# EAGLE design ppt_full_charger_f1 (EAGLE 8.7.1)

## Sheet 1 of 3
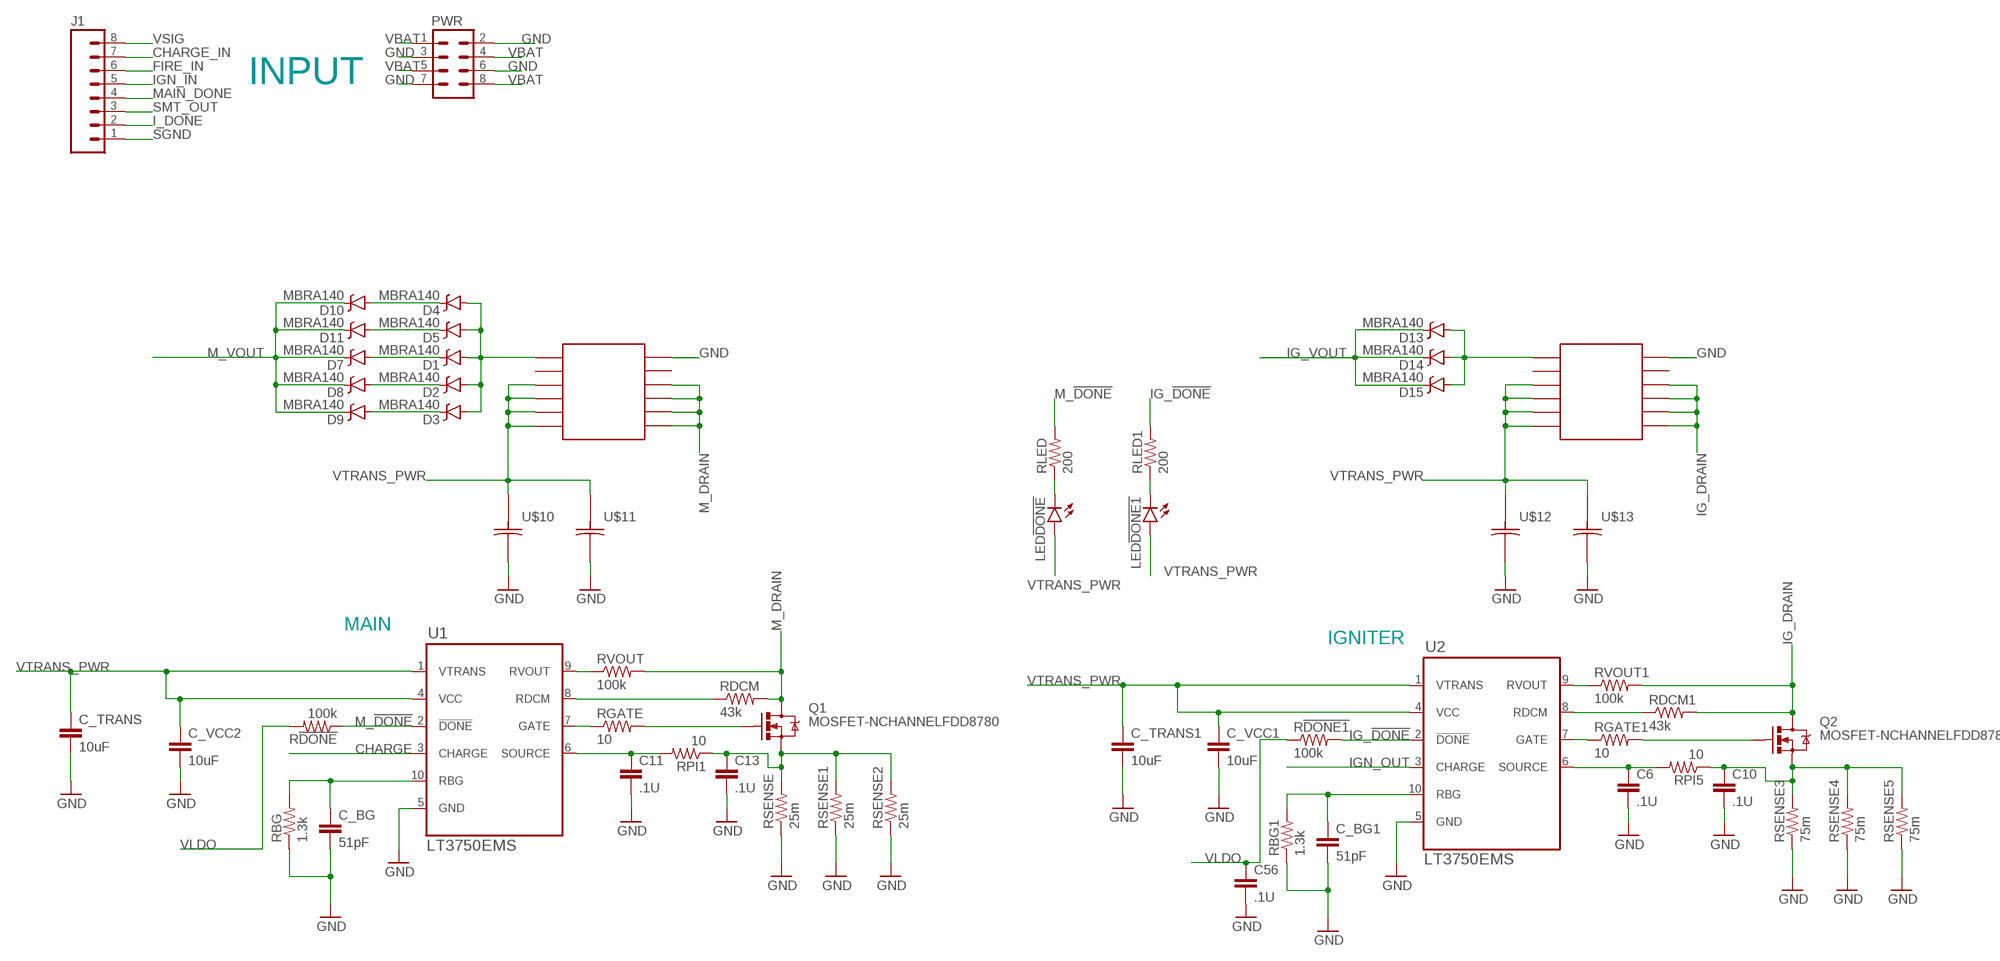
[diagram p0: schematic, sheet 1]

### Parts
C6  .1U  CAP0805  [0805]
C10  .1U  CAP0805  [0805]
C11  .1U  CAP0805  [0805]
C13  .1U  CAP0805  [0805]
C56  .1U  CAP0805  [0805]
C_BG  51pF  CAP0805  [0805]
C_BG1  51pF  CAP0805  [0805]
C_TRANS  10uF  CAP0805  [0805]
C_TRANS1  10uF  CAP0805  [0805]
C_VCC1  10uF  CAP0805  [0805]
C_VCC2  10uF  CAP0805  [0805]
D1  MBRA140  [SMA-DIODE]
D2  MBRA140  [SMA-DIODE]
D3  MBRA140  [SMA-DIODE]
D4  MBRA140  [SMA-DIODE]
D5  MBRA140  [SMA-DIODE]
D7  MBRA140  [SMA-DIODE]
D8  MBRA140  [SMA-DIODE]
D9  MBRA140  [SMA-DIODE]
D10  MBRA140  [SMA-DIODE]
D11  MBRA140  [SMA-DIODE]
D13  MBRA140  [SMA-DIODE]
D14  MBRA140  [SMA-DIODE]
D15  MBRA140  [SMA-DIODE]
J1  M08  [1X08_ROUND]
LED!DONE  LED1206  [LED-1206]
LED!DONE1  LED1206  [LED-1206]
PWR  M04X2  [2X4]
Q1  MOSFET-NCHANNELFDD8780  [DPAK]
Q2  MOSFET-NCHANNELFDD8780  [DPAK]
R!DONE  100k  RESISTOR0805-RES  [0805]
R!DONE1  100k  RESISTOR0805-RES  [0805]
RBG  1.3k  RESISTOR0805-RES  [0805]
RBG1  1.3k  RESISTOR0805-RES  [0805]
RDCM  43k  RESISTOR0805-RES  [0805]
RDCM1  43k  RESISTOR0805-RES  [0805]
RGATE  10  RESISTOR0805-RES  [0805]
RGATE1  10  RESISTOR0805-RES  [0805]
RLED  200  RESISTOR0805-RES  [0805]
RLED1  200  RESISTOR0805-RES  [0805]
RPI1  10  RESISTOR0805-RES  [0805]
RPI5  10  RESISTOR0805-RES  [0805]
RSENSE  25m  RESISTOR1206  [1206]
RSENSE1  25m  RESISTOR1206  [1206]
RSENSE2  25m  RESISTOR1206  [1206]
RSENSE3  75m  RESISTOR1206  [1206]
RSENSE4  75m  RESISTOR1206  [1206]
RSENSE5  75m  RESISTOR1206  [1206]
RVOUT  100k  RESISTOR0805-RES  [0805]
RVOUT1  100k  RESISTOR0805-RES  [0805]
U1  LT3750EMS  [MSOP10]
U2  LT3750EMS  [MSOP10]
U$1  COILCRAFT_DA2034  [DA2034]
U$2  COILCRAFT_DA2033  [DA2033]
U$10  PANASONIC_16SVPG270M  [PANASONIC_SVPG]
U$11  PANASONIC_16SVPG270M  [PANASONIC_SVPG]
U$12  PANASONIC_16SVPG270M  [PANASONIC_SVPG]
U$13  PANASONIC_16SVPG270M  [PANASONIC_SVPG]

### Nets
7: RGATE1.1 U2.7(GATE)
8: RDCM1.1 U2.8(RDCM)
9: RVOUT1.1 U2.9(RVOUT)
CHARGE: U1.3(CHARGE) ; also sheet 3
CHARGE_IN: J1.7 ; also sheet 3
FIRE_IN: J1.6 ; also sheet 3
GND: C6.2 C10.2 C11.2 C13.2 C56.2 C_BG1.2 C_BG.2 C_TRANS1.2 C_TRANS.2 C_VCC1.2 C_VCC2.2 PWR.2 PWR.3 PWR.6 PWR.7 RBG1.1 RBG.1 RSENSE1.1 RSENSE2.1 RSENSE3.1 RSENSE4.1 RSENSE5.1 RSENSE.1 U1.5(GND) U2.5(GND) U$1.P$12 U$2.P$12 U$10.NEG U$11.NEG U$12.NEG U$13.NEG ; also sheet 2,3
I_DONE: J1.2 ; also sheet 3
IG_!DONE: R!DONE1.2 RLED1.2 U2.2(!DONE) ; also sheet 3
IG_BG: C_BG1.1 RBG1.2 U2.10(RBG)
IG_DRAIN: Q2.4(D) RDCM1.2 RVOUT1.2 U$2.P$7 U$2.P$8 U$2.P$9 U$2.P$10
IG_GATE: Q2.1(G) RGATE1.2
IG_SENSE: C10.1 Q2.3(S) RPI5.1 RSENSE3.2 RSENSE4.2 RSENSE5.2
IG_VOUT: D13.C D14.C D15.C ; also sheet 2
IGN_IN: J1.5 ; also sheet 3
IGN_OUT: U2.3(CHARGE) ; also sheet 3
M_!DONE: R!DONE.1 RLED.2 U1.2(!DONE) ; also sheet 3
M_BG: C_BG.1 RBG.2 U1.10(RBG)
M_DRAIN: Q1.4(D) RDCM.2 RVOUT.2 U$1.P$7 U$1.P$8 U$1.P$9 U$1.P$10
M_GATE: Q1.1(G) RGATE.2
M_SENSE: C13.1 Q1.3(S) RPI1.1 RSENSE1.2 RSENSE2.2 RSENSE.2
M_VOUT: D7.C D8.C D9.C D10.C D11.C ; also sheet 2
MAIN_DONE: J1.4 ; also sheet 3
N$1: C6.1 RPI5.2 U2.6(SOURCE)
N$3: RVOUT.1 U1.9(RVOUT)
N$4: D4.C D10.A
N$5: RDCM.1 U1.8(RDCM)
N$6: RGATE.1 U1.7(GATE)
N$7: D5.C D11.A
N$10: D1.C D7.A
N$11: D2.C D8.A
N$12: D3.C D9.A
N$15: LED!DONE.C RLED.1
N$17: LED!DONE1.C RLED1.1
N$18: D1.A D2.A D3.A D4.A D5.A U$1.P$1
N$20: C11.1 RPI1.2 U1.6(SOURCE)
N$24: D13.A D14.A D15.A U$2.P$1
SGND: J1.1 ; also sheet 3
SMT_OUT: J1.3 ; also sheet 3
VBAT: PWR.1 PWR.4 PWR.5 PWR.8 ; also sheet 3
VLDO: C56.1 R!DONE1.1 R!DONE.2 ; also sheet 2,3
VSIG: J1.8 ; also sheet 3
VTRANS_PWR: C_TRANS1.1 C_TRANS.1 C_VCC1.1 C_VCC2.1 LED!DONE1.A LED!DONE.A U1.1(VTRANS) U1.4(VCC) U2.1(VTRANS) U2.4(VCC) U$1.P$3 U$1.P$4 U$1.P$5 U$1.P$6 U$2.P$3 U$2.P$4 U$2.P$5 U$2.P$6 U$10.POS U$11.POS U$12.POS U$13.POS ; also sheet 2,3
Unconnected: U$1.P$2 U$1.P$11 U$2.P$2 U$2.P$11

### Notes on the sheet
- INPUT
- MAIN
- IGNITER

## Sheet 2 of 3
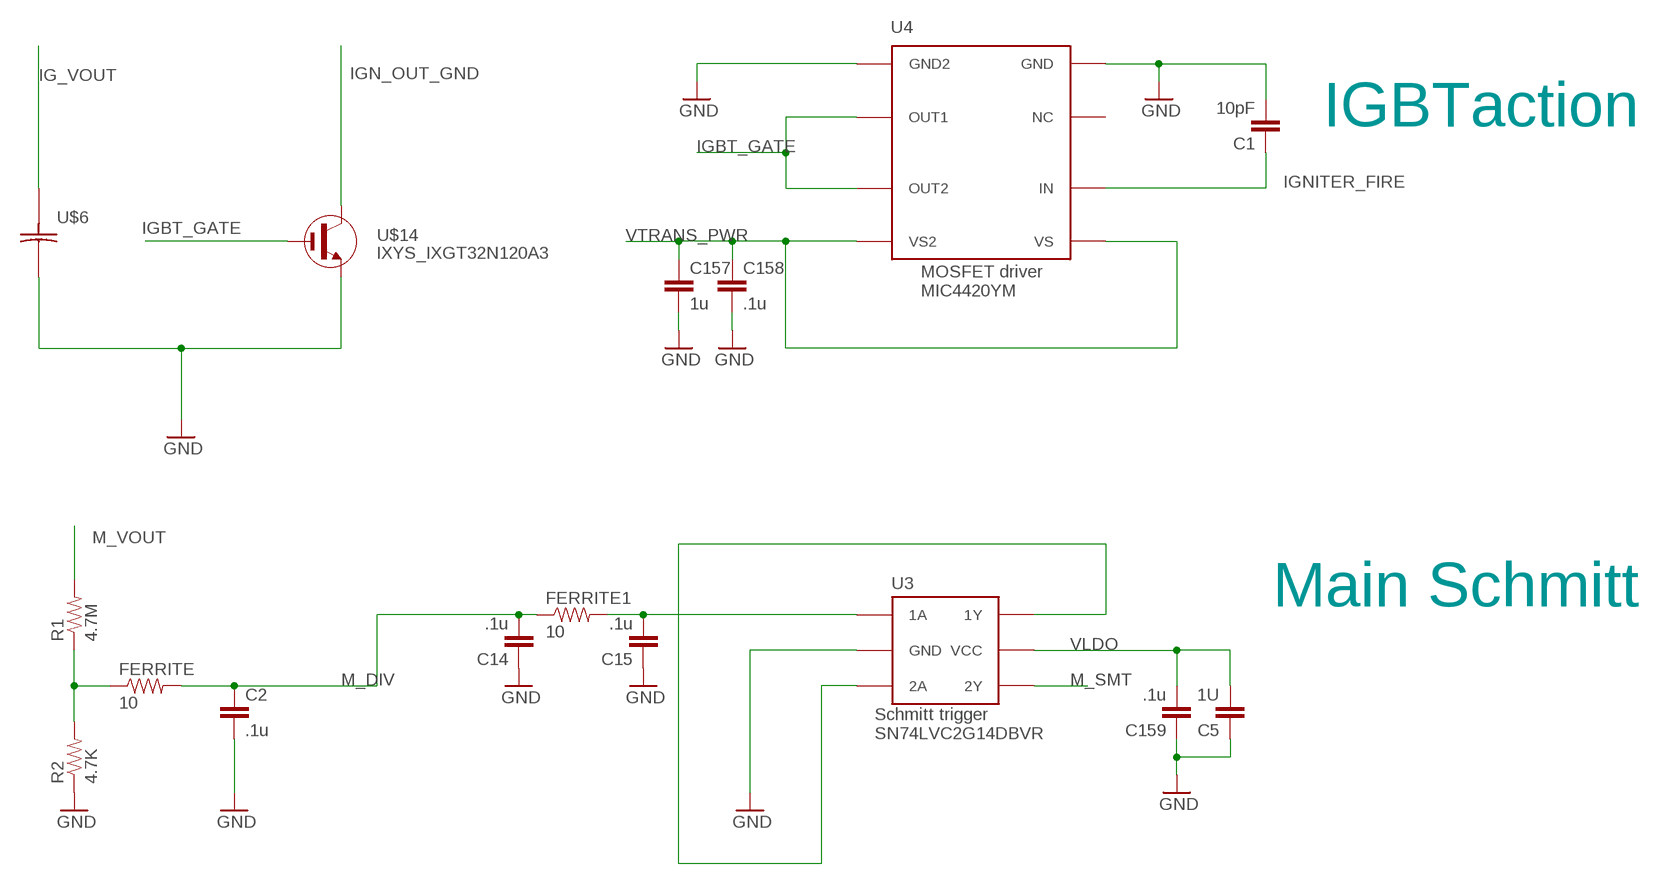
[diagram p1: schematic, sheet 2]

### Parts
C1  10pF  CAP0805  [0805]
C2  .1u  CAP0805  [0805]
C5  1U  CAP0805  [0805]
C14  .1u  CAP0805  [0805]
C15  .1u  CAP0805  [0805]
C157  1u  CAP0805  [0805]
C158  .1u  CAP0805  [0805]
C159  .1u  CAP0805  [0805]
FERRITE  10  RESISTOR0805-RES  [0805]
FERRITE1  10  RESISTOR0805-RES  [0805]
R1  4.7M  RESISTOR2010  [R2010]
R2  4.7K  RESISTOR2010  [R2010]
U3  TI_SCHMITTRIGGER_SN74  [SOT-23-6]
U4  MICREL_MOSFETDRIVER_MIC4420  [8-SOIC]
U$6  KEMET_LDEQH3100KA5N00  [KEMET_F3078]
U$14  IXYS_IXGT32N120A3  [TO-268]

### Nets
GND: C1.2 C2.2 C5.1 C14.1 C15.1 C157.2 C158.2 C159.1 R2.1 U3.P$2(GND) U4.P$4(GND) U4.P$5(GND2) U$6.NEG U$14.3(E) ; also sheet 1,3
IG_VOUT: U$6.POS ; also sheet 1
IGBT_GATE: U4.P$6(OUT1) U4.P$7(OUT2) U$14.1(G)
IGN_OUT_GND: U$14.2(C)
IGNITER_FIRE: C1.1 U4.P$2(IN) ; also sheet 3
M_DIV: C2.1 C14.2 FERRITE1.1 FERRITE.2
M_SMT: U3.P$4(2Y) ; also sheet 3
M_VOUT: R1.2 ; also sheet 1
N$2: U3.P$3(2A) U3.P$6(1Y)
N$8: C15.2 FERRITE1.2 U3.P$1(1A)
N$14: FERRITE.1 R1.1 R2.2
VLDO: C5.2 C159.2 U3.P$5(VCC) ; also sheet 1,3
VTRANS_PWR: C157.1 C158.1 U4.P$1(VS) U4.P$8(VS2) ; also sheet 1,3
Unconnected: U4.P$3(NC)

### Notes on the sheet
- IGBTaction
- Main Schmitt

## Sheet 3 of 3
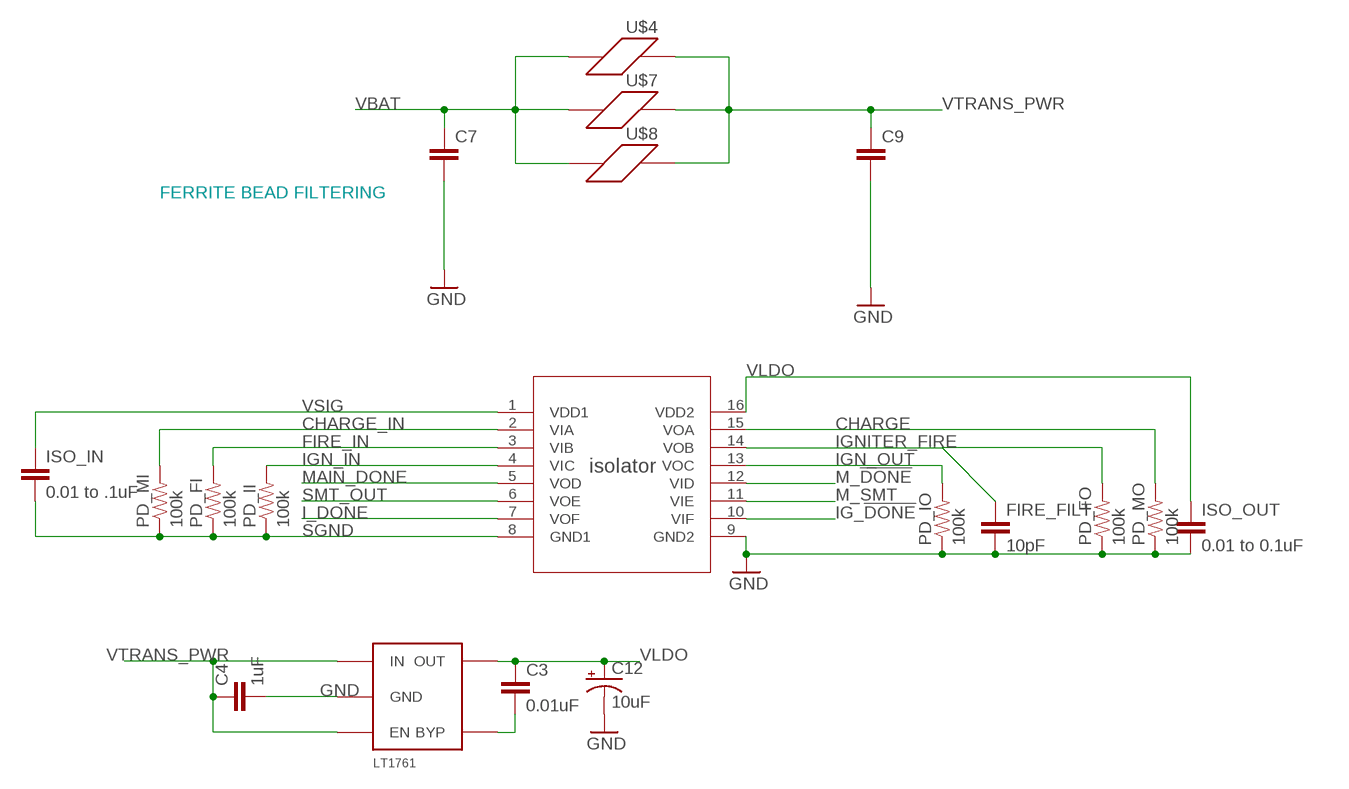
[diagram p2: schematic, sheet 3]

### Parts
ADUM163N  ADUM163N1BRZ  [R_16]
C3  0.01uF  CAP0805  [0805]
C4  1uF  CAP0805  [0805]
C7  CAP0805  [0805]
C9  CAP0805  [0805]
C12  10uF  10UF-TANT  [EIA3216]
FIRE_FILT  10pF  CAP0805  [0805]
ISO_IN  0.01 to .1uF  CAP0805  [0805]
ISO_OUT  0.01 to 0.1uF  CAP0805  [0805]
LDO  LINEAR_LDO_LT1761-X  [SOT-23-5]
PD_FI  100k  RESISTOR0805-RES  [0805]
PD_FO  100k  RESISTOR0805-RES  [0805]
PD_II  100k  RESISTOR0805-RES  [0805]
PD_IO  100k  RESISTOR0805-RES  [0805]
PD_MI  100k  RESISTOR0805-RES  [0805]
PD_MO  100k  RESISTOR0805-RES  [0805]
U$4  B.L1_FBMJ2125HS420-T  [0805]
U$7  B.L2_FBMH1608HL121-T  [0603]
U$8  I.L1_587-3855-1-ND  [1206]

### Nets
CHARGE: ADUM163N.15(VOA) PD_MO.2 ; also sheet 1
CHARGE_IN: ADUM163N.2(VIA) PD_MI.2 ; also sheet 1
FIRE_IN: ADUM163N.3(VIB) PD_FI.2 ; also sheet 1
GND: ADUM163N.9(GND2) C4.2 C7.2 C9.2 C12.C(-) FIRE_FILT.2 ISO_OUT.2 LDO.P$2(GND) PD_FO.1 PD_IO.1 PD_MO.1 ; also sheet 1,2
I_DONE: ADUM163N.7(VOF) ; also sheet 1
IG_!DONE: ADUM163N.10(VIF) ; also sheet 1
IGN_IN: ADUM163N.4(VIC) PD_II.2 ; also sheet 1
IGN_OUT: ADUM163N.13(VOC) PD_IO.2 ; also sheet 1
IGNITER_FIRE: ADUM163N.14(VOB) FIRE_FILT.1 PD_FO.2 ; also sheet 2
M_!DONE: ADUM163N.12(VID) ; also sheet 1
M_SMT: ADUM163N.11(VIE) ; also sheet 2
MAIN_DONE: ADUM163N.5(VOD) ; also sheet 1
N$25: C3.2 LDO.P$4(BYP)
SGND: ADUM163N.8(GND1) ISO_IN.2 PD_FI.1 PD_II.1 PD_MI.1 ; also sheet 1
SMT_OUT: ADUM163N.6(VOE) ; also sheet 1
VBAT: C7.1 U$4.1 U$7.1 U$8.1 ; also sheet 1
VLDO: ADUM163N.16(VDD2) C3.1 C12.A(+) ISO_OUT.1 LDO.P$5(OUT) ; also sheet 1,2
VSIG: ADUM163N.1(VDD1) ISO_IN.1 ; also sheet 1
VTRANS_PWR: C4.1 C9.1 LDO.P$1(IN) LDO.P$3(EN) U$4.2 U$7.2 U$8.2 ; also sheet 1,2

### Notes on the sheet
- FERRITE BEAD FILTERING

## Library data of the parts
ADUM163N = paige1:ADUM163N1BRZ
C1 C2 C5-C7 C9-C11 C13-C15 C56 C157-C159 C_BG C_BG1 C_TRANS C_TRANS1 C_VCC1 C_VCC2 = SparkFun-Capacitors:CAP: Capacitor Standard 0603 ceramic capacitor, and 0.1" leaded capacitor.
C3 C4 FIRE_FILT ISO_IN ISO_OUT = SparkFun-Passives:CAP: Capacitor Standard 0603 ceramic capacitor, and 0.1" leaded capacitor.
C12 = SparkFun-Retired:10UF-TANT: 10uF Tantalum SMT CAP-00811- 16V 10% (EIA-3216); PROD_ID: CAP-00811
D1-D5 D7-D11 D13-D15 = SparkFun-DiscreteSemi:MBRA140: 40V, 1A Schottky rectifier SMA/DO-214AC package DIO-08053; PROD_ID: DIO-08053
FERRITE FERRITE1 PD_FI PD_FO PD_II PD_IO PD_MI PD_MO R1 R2 RLED RLED1 = SparkFun-Passives:RESISTOR: Resistor Basic schematic elements and footprints for 0603, 1206, and PTH resistors.
J1 = SparkFun-Connectors:M08: Header 8 Standard 8-pin 0.1" header. Use with straight break away headers (SKU : PRT-00116), right angle break away headers (PRT-00553), swiss pins (PRT-00743), machine pins (PRT-00117), and female headers (PRT-00115).; PROD_ID: CONN-08437
LDO = DubSat1 Components:LINEAR_LDO_LT1761-X
LED!DONE LED!DONE1 = SparkFun-LED:LED: LEDs Standard schematic elements and footprints for 5mm, 3mm, 1206, and 0603 sized LEDs. 5mm - Spark Fun Electronics SKU : COM-00529 (and others)
PWR = SparkFun-Connectors:M04X2: .1" header, two rows of four.
Q1 Q2 = SparkFun-DiscreteSemi:MOSFET-NCHANNEL: Common NMOSFET Parts MFG P/N Store ID Prod ID FDD8780 TRANS-09984 SI7820DN TRANS-11055 FDS6630A IC-08089 2N7002PW TRANS-11151 FQP30N06L COM-10213 TRANS-10060 BSS123LT1G TRANS-08345 BSS138 TRANS-00830 BS170 2N7000; PROD_ID: TRANS-09984
R!DONE R!DONE1 RBG RBG1 RDCM RDCM1 RGATE RGATE1 RPI1 RPI5 RVOUT RVOUT1 = SparkFun-Resistors:RESISTOR: Resistor Basic schematic elements and footprints for 0603, 1206, and PTH resistors.
RSENSE RSENSE1-RSENSE5 = DubSat1 Components:RESISTOR: Resistor Basic schematic elements and footprints for 0603, 1206, and PTH resistors.
U1 U2 = linear-technology:LT3750EMS: Description: The LT®3750 is a flyback converter designed to rapidly charge large capacitors to a user-adjustable target voltage. See more information in the datasheet at: http://cds.linear.com/docs/en/datasheet/3750fa.pdf
U3 = ICs:TI_SCHMITTRIGGER_SN74
U4 = ICs:MICREL_MOSFETDRIVER_MIC4420
U$1 = Transformers:COILCRAFT_DA2034
U$2 = Transformers:COILCRAFT_DA2033
U$4 = Ferrite:B.L1_FBMJ2125HS420-T: Taiyo Yuden 0805 package ferrite bead high frequency filter. Download the datasheet here <http://ds.yuden.co.jp/TYCOMPAS/ut/detail.do?productNo=FBMJ2125HS420-T&fileName=FBMJ2125HS420-T_SS&mode=specSheetDownload>.
U$6 = Capacitors:KEMET_LDEQH3100KA5N00
U$7 = Ferrite:B.L2_FBMH1608HL121-T: Taiyo Yuden 0603 package ferrite bead high frequency filter. Download the datasheet here <http://ds.yuden.co.jp/TYCOMPAS/ut/detail.do?productNo=FBMJ2125HS420-T&fileName=FBMJ2125HS420-T_SS&mode=specSheetDownload>.
U$8 = Ferrite:I.L1_587-3855-1-ND: Taiyo Yuden 1206 package ferrite bead high frequency filter. Download the datasheet here <http://ds.yuden.co.jp/TYCOMPAS/ut/detail.do?productNo=FBMJ3216HS480NTV&fileName=FBMJ3216HS480NTV_SS&mode=specSheetDownload>.
U$10-U$13 = Capacitors:PANASONIC_16SVPG270M
U$14 = Semiconductors:IXYS_IXGT32N120A3

## Board
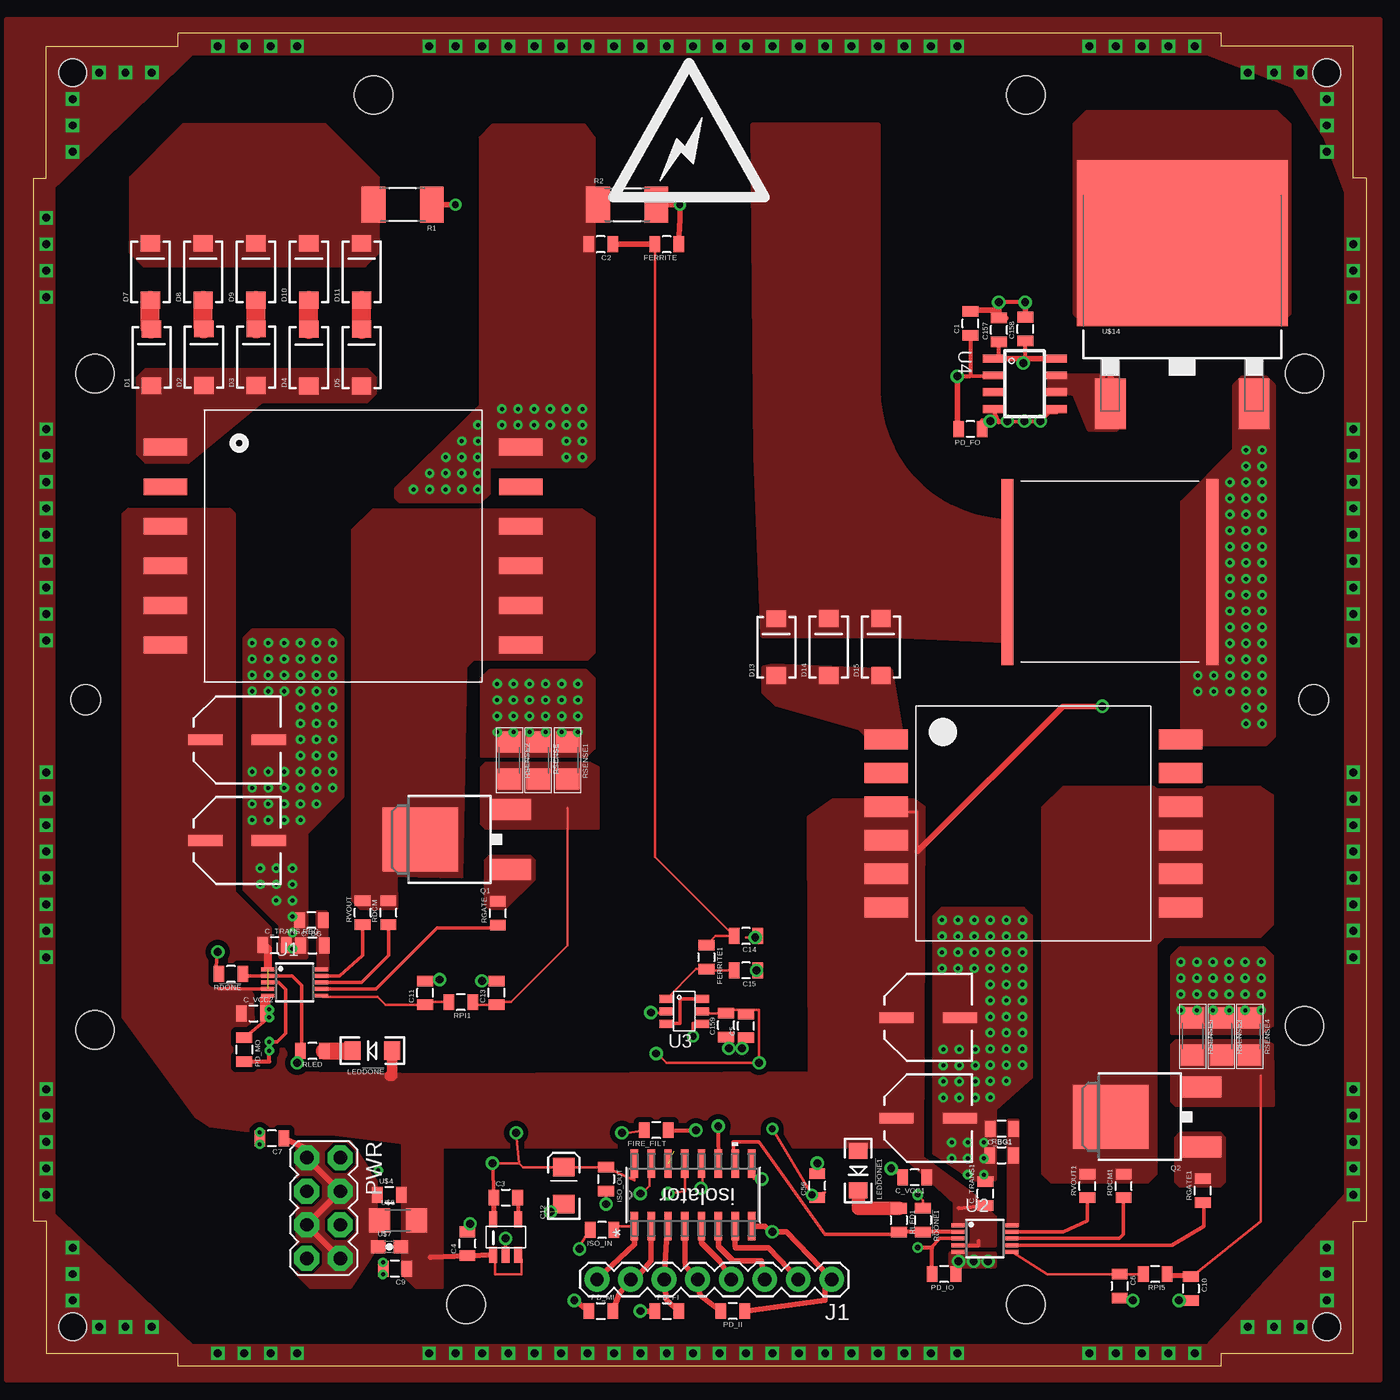
[diagram p3: board, top side]
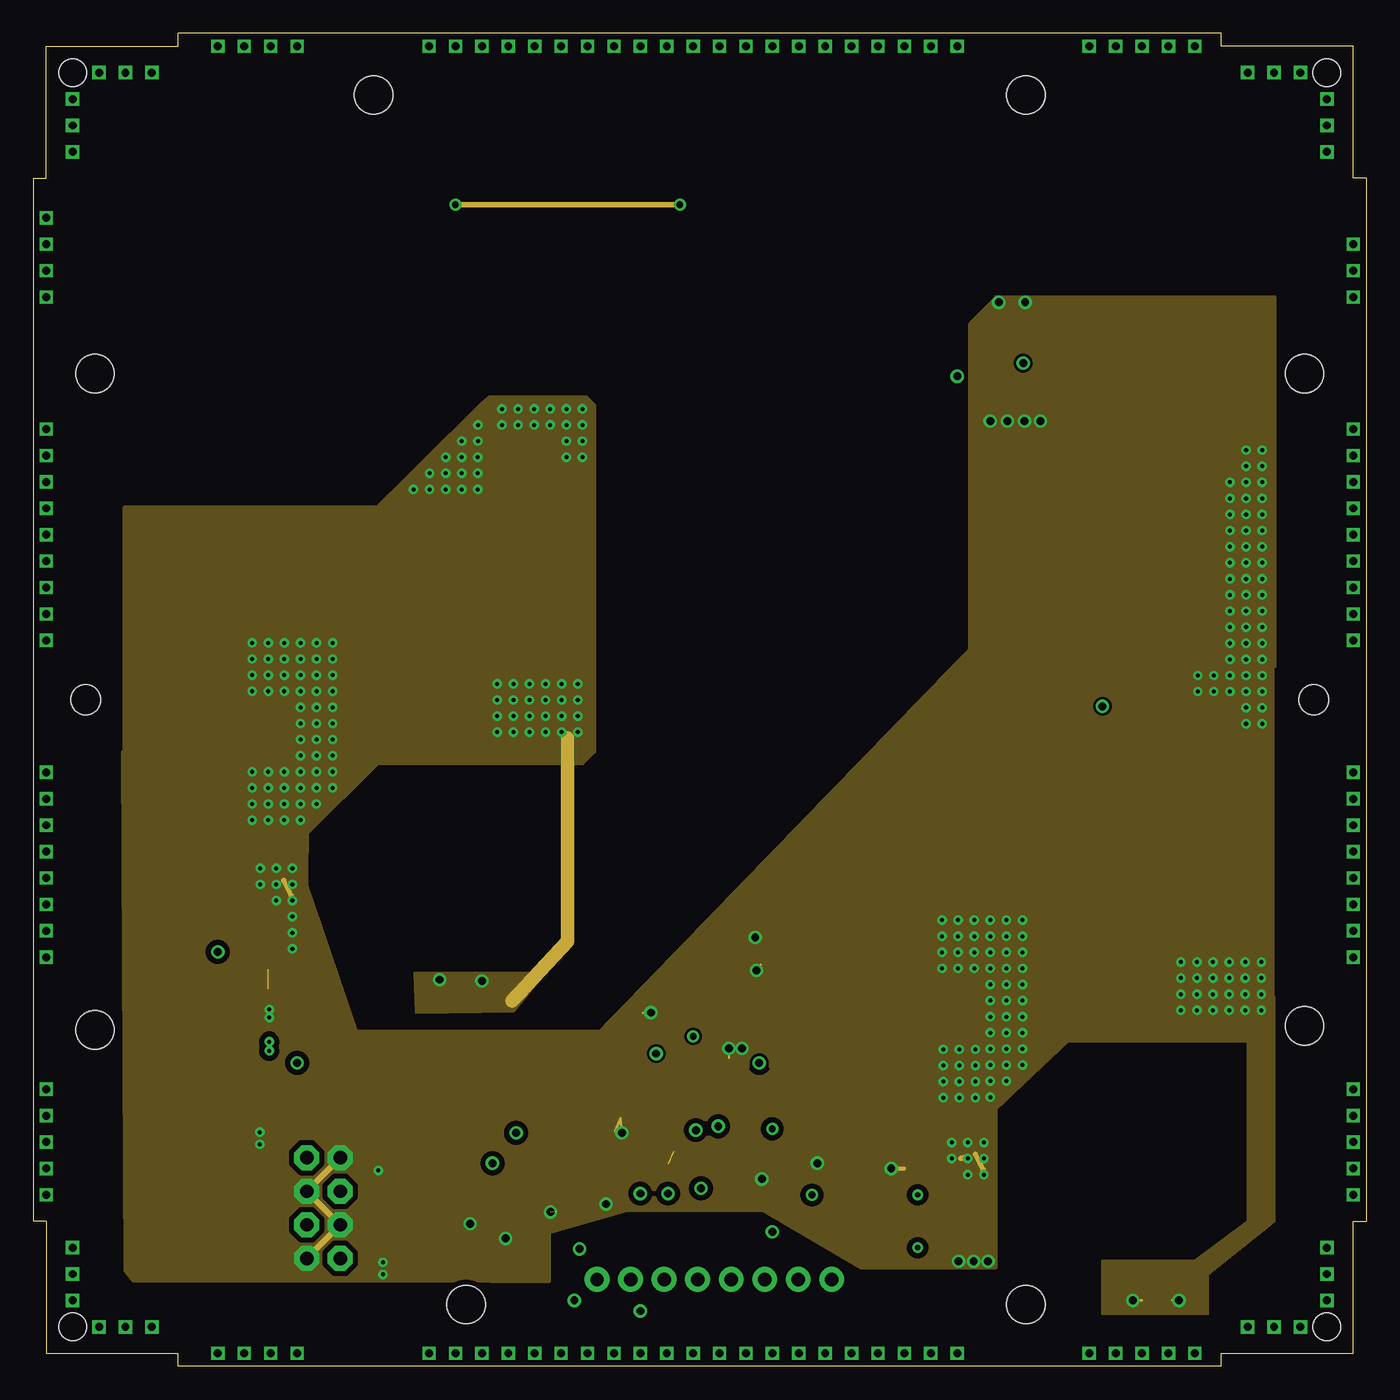
[diagram p4: board, inner layer GROUND]
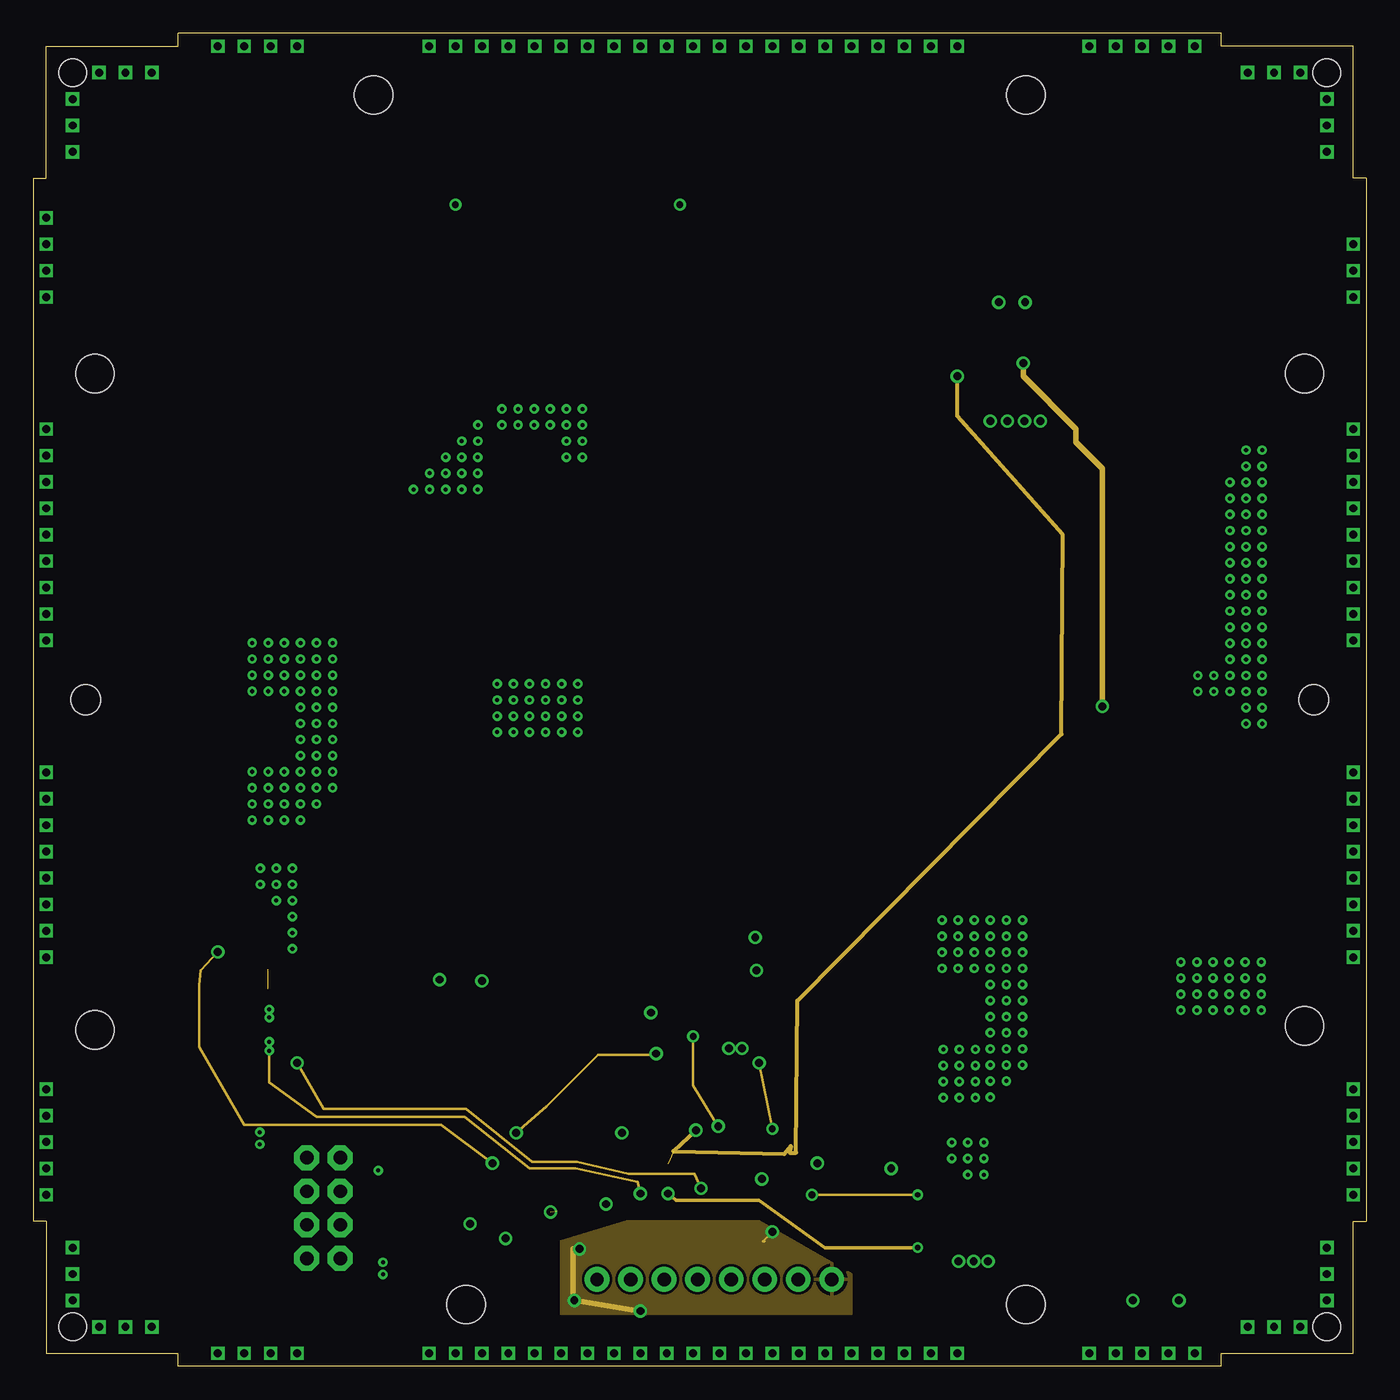
[diagram p5: board, inner layer Layer3]
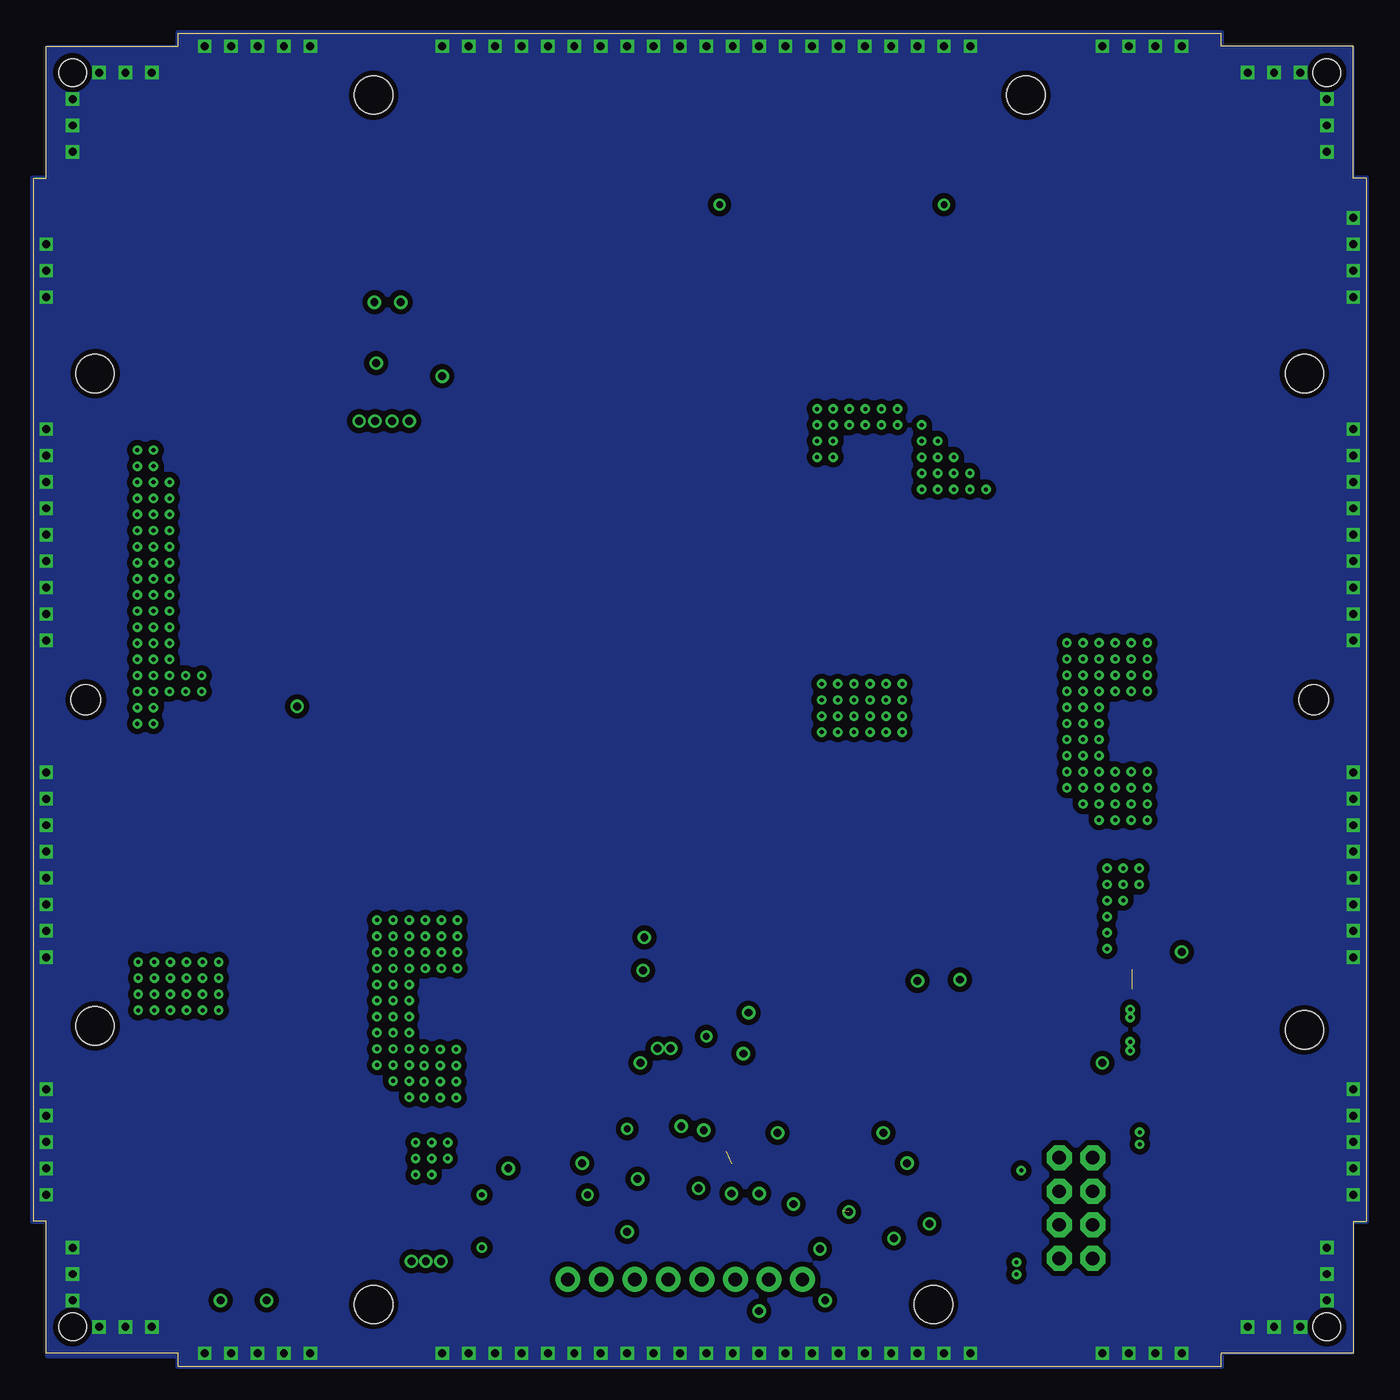
[diagram p6: board, bottom side, seen from below]

Size 101 x 101 mm. Coordinates in mm from the lower left corner, seen from the top.
Outline: 90,101 11,101 11,100 1,100 1,90 0,90 0,11 1,11 1,1 11,1 11,0 90,0 90,1 100,1 100,11 101,11 101,90 100,90 100,100 90,100 90,101
Copper layers (1*2*3*16): Top 0.035mm / dielectric 1.5mm / GROUND 0.035mm / dielectric 0.15mm / Layer3 0.035mm / dielectric 0.2mm / Faraday_GROUND 0.035mm
Design rules "default *": minimum track width 10mil, minimum drill 24mil, track to track 8mil, track to pad 8mil, pad to pad 6mil, via to via 8mil, smd to smd 8mil, copper to edge 0mil, drill to drill 8mil, minimum pad ring 10mil, minimum via ring 8mil, stop-mask expansion 4mil, vias tented up to drill 0mil, thermal gap 10mil
Holes 2.9 mm at 4.7,25.5 32.8,4.7 75.2,4.7 96.3,25.8 96.3,75.2 75.2,96.3 25.8,96.3 4.7,75.2
Holes 2.26 mm at 4,50.5 97,50.5
Holes 2.1 mm at 3,98 3,3 98,3 98,98

### Footprints (pad centres in the part's own frame; a part is rotated, then mirrored left to right if it is on the bottom)
R_16 = smd 2.18 x 0.561: 1 -2.364,4.445; 2 -2.364,3.175; 3 -2.364,1.905; 4 -2.364,0.635; 5 -2.364,-0.635; 6 -2.364,-1.905; 7 -2.364,-3.175; 8 -2.364,-4.445; 9 2.364,-4.445; 10 2.364,-3.175; 11 2.364,-1.905; 12 2.364,-0.635; 13 2.364,0.635; 14 2.364,1.905; 15 2.364,3.175; 16 2.364,4.445
0805 = smd 0.8 x 1.2: 1 -0.9,0; 2 0.9,0
EIA3216 = smd 1.4 x 1.6: A 1.4,0; C -1.4,0
SMA-DIODE = smd 1.27 x 1.47: A -2.15,0; C 2.15,0
1X08_ROUND = drill 1.016 pad 1.88: 1 0,0; 2 2.54,0; 3 5.08,0; 4 7.62,0; 5 10.16,0; 6 12.7,0; 7 15.24,0; 8 17.78,0
SOT-23-5 = smd 0.6 x 1.2: P$1 -0.95,-1.35; P$2 0,-1.35; P$3 0.95,-1.35; P$4 0.95,1.35; P$5 -0.95,1.35
LED-1206 = smd 1.2 x 1.4: A -1.5,0; C 1.5,0
2X4 = drill 1.016 pad 1.88 octagon: 1 -3.81,-1.27; 2 -3.81,1.27; 3 -1.27,-1.27; 4 -1.27,1.27; 5 1.27,-1.27; 6 1.27,1.27; 7 3.81,-1.27; 8 3.81,1.27
DPAK = smd 1.6 x 3: 1 -2.28,-5.31; 3 2.28,-5.31 | smd 4.826 x 5.715: 4 0,1.588
R2010 = smd 1.8 x 2.7: 1 -2.2,0; 2 2.2,0
1206 = smd 1.6 x 1.8: 1 -1.4,0; 2 1.4,0
MSOP10 = smd 0.3 x 1: 1 -1,-2.05; 2 -0.5,-2.05; 3 0,-2.05; 4 0.5,-2.05; 5 1,-2.05; 6 1,2.05; 7 0.5,2.05; 8 0,2.05; 9 -0.5,2.05; 10 -1,2.05
SOT-23-6 = smd 0.6 x 1.05: P$1 -0.95,-1.35; P$2 0,-1.35; P$3 0.95,-1.35; P$4 0.95,1.35; P$5 0,1.35; P$6 -0.95,1.35
8-SOIC = smd 0.6 x 1.55: P$1 -1.905,-2.4; P$2 -0.635,-2.4; P$3 0.635,-2.4; P$4 1.905,-2.4; P$5 1.905,2.4; P$6 0.635,2.4; P$7 -0.635,2.4; P$8 -1.905,2.4
DA2034 = smd 3.302 x 1.27: P$1 -13.462,7.493; P$2 -13.462,4.496; P$3 -13.462,1.499; P$4 -13.462,-1.499; P$5 -13.462,-4.496; P$6 -13.462,-7.493; P$7 13.462,-7.493; P$8 13.462,-4.496; P$9 13.462,-1.499; P$10 13.462,1.499; P$11 13.462,4.496; P$12 13.462,7.493
DA2033 = smd 3.302 x 1.524: P$1 -11.151,6.35; P$2 -11.151,3.81; P$3 -11.151,1.27; P$4 -11.151,-1.27; P$5 -11.151,-3.81; P$6 -11.151,-6.35; P$7 11.151,-6.35; P$8 11.151,-3.81; P$9 11.151,-1.27; P$10 11.151,1.27; P$11 11.151,3.81; P$12 11.151,6.35
KEMET_F3078 = smd 0.9 x 14.1: NEG 7.5,-0.5; POS -8,-0.5
0603 = smd 1.1 x 1: 1 -0.85,0; 2 0.85,0
PANASONIC_SVPG = smd 0.8 x 2.6: NEG 0,2.4; POS 0,-2.4
TO-268 = smd 2.32 x 3.81: 1 -5.45,-8.045; 3 5.45,-8.045 | smd 15.95 x 12.55: 2 0,4.125

### Placement (x,y rotation side)
ADUM163N  50,13 90 top
C1  71,79 90 top
C2  43,85 180 top
C3  35.8,12.8 0 top
C4  32.9,9.3 90 top
C5  54,25.8 90 top
C6  82.3,6.1 270 top
C7  18.09,17.28 180 top
C9  27.42,7.41 180 top
C10  87.7,5.9 270 top
C11  29.7,28.3 90 top
C12  40.2,13.7 90 top
C13  35.1,28.3 90 top
C14  54,32.6 180 top
C15  54,30 180 top
C56  59.4,13.7 90 top
C157  73.16,78.52 90 top
C158  75.16,78.58 90 top
C159  52.5,25.86 90 top
C_BG  21.09,33.8 180 top
C_BG1  73.38,18.01 180 top
C_TRANS  18.3,31.92 0 top
C_TRANS1  72.14,13.1 90 top
C_VCC1  66.78,14.33 180 top
C_VCC2  16.7,26.74 0 top
D1  8.99,76.43 90 top
D2  12.94,76.44 90 top
D3  16.9,76.44 90 top
D4  20.89,76.41 90 top
D5  24.89,76.41 90 top
D7  8.89,82.91 90 top
D8  12.89,82.91 90 top
D9  16.89,82.91 90 top
D10  20.89,82.91 90 top
D11  24.89,82.91 90 top
D13  56.3,54.48 90 top
D14  60.26,54.49 90 top
D15  64.22,54.49 90 top
FERRITE  48,85 180 top
FERRITE1  51,31 270 top
FIRE_FILT  47.2,17.9 180 top
ISO_IN  43.1,10.34 180 top
ISO_OUT  43.4,14.2 270 top
J1  60.5,6.6 180 top
LDO  35.8,9.8 0 top
LED!DONE  25.7,23.91 180 top
LED!DONE1  62.52,14.84 270 top
PD_FI  48,4.2 0 top
PD_FO  71,71 180 top
PD_II  53,4.2 180 top
PD_IO  69,7 180 top
PD_MI  43,4.2 0 top
PD_MO  16,24 270 top
PWR  22,12 270 top
Q1  30.92,39.92 90 top
Q2  83.21,18.91 90 top
R1  28,88 180 top
R2  45,88 0 top
R!DONE  14.99,29.73 180 top
R!DONE1  67.4,11.09 270 top
RBG  21.17,31.9 0 top
RBG1  73.36,16 0 top
RDCM  26.92,34.38 90 top
RDCM1  82.6,13.68 90 top
RGATE  35.21,34.33 90 top
RGATE1  88.6,13.32 90 top
RLED  21.16,23.9 180 top
RLED1  65.58,11.08 270 top
RPI1  32.4,27.6 180 top
RPI5  85,7 180 top
RSENSE  38.27,45.91 270 top
RSENSE1  40.5,45.91 270 top
RSENSE2  36.08,45.91 270 top
RSENSE3  90.02,25.01 270 top
RSENSE4  92.15,25.01 270 top
RSENSE5  87.83,25.01 270 top
RVOUT  24.97,34.38 90 top
RVOUT1  79.86,13.68 90 top
U1  19.81,29.09 270 top
U2  72.1,9.69 270 top
U3  49.33,26.91 270 top
U4  75.12,74.43 270 top
U$1  23.48,62.14 0 top
U$2  75.77,41.13 0 top
U$3  [ICON_BOLT-L]  49.7,93 0 top
U$4  26.99,13 0 top
U$6  81.81,60.67 0 top
U$7  27,9.06 0 top
U$8  27.64,11.06 0 top
U$10  15.46,39.84 270 top
U$11  15.46,47.46 270 top
U$12  67.8,18.81 270 top
U$13  67.8,26.43 270 top
U$14  87.05,80.96 0 top

### Tracks (layer width: path | path; a pad name or v marks a point on that pad's centre or on a via)
7
  Top 0.254: U2.7 86.26,9.19 88.7,10.63 88.7,12.32 RGATE1.1
8
  Top 0.254: U2.8 82.27,9.69 82.6,10.02 RDCM1.1
9
  Top 0.254: U2.9 78.03,10.19 79.86,11.02 RVOUT1.1
BODY  (via drill 0.6)
  other vias: 1,87 1,85 1,83 1,81 1,71 1,33 1,31 1,21 1,19 1,17 1,15 1,13 1,41 1,39 1,37 1,35 1,45 1,43 1,65 1,63 1,61 1,59 1,57 1,55 1,69 1,67 100,85 100,83 100,81 100,71 100,33 100,31 100,21 100,19 100,17 100,15 100,13 100,41 100,39 100,37 100,35 100,45 100,43 100,65 100,63 100,61 100,59 100,57 100,55 100,69 100,67 14,1 16,1 18,1 20,1 30,1 68,1 70,1 80,1 82,1 84,1 86,1 88,1 60,1 62,1 64,1 66,1 54,1 56,1 58,1 36,1 38,1 40,1 42,1 44,1 46,1 32,1 34,1 48,1 50,1 52,1 16,100 18,100 20,100 30,100 68,100 70,100 80,100 82,100 84,100 86,100 88,100 60,100 62,100 64,100 66,100 54,100 56,100 58,100 36,100 38,100 40,100 42,100 44,100 46,100 32,100 34,100 48,100 50,100 52,100 5,98 7,98 9,98 3,96 3,94 3,92 98,96 98,94 98,92 96,98 94,98 92,98 96,3 94,3 92,3 98,5 98,7 98,9 3,5 3,7 3,9 5,3 7,3 9,3 14,100
  pour Faraday_GROUND (isolate 0.406): 0,90 0,11 1.13,11 1.13,1.13 11,1.13 11,0 90,0 90,0.83 99.89,0.83 99.89,11 101.02,11 101.02,90 99.89,90 99.89,99.89 90,99.89 90,101.02 11,101.02 11,99.89 1.13,99.89 1.13,90
  pour Top: -2,86 12,99.5 89,99.5 95.5,97 98,93 99.5,89 99.5,13 89,1.5 12,1.5 1.5,11.5 1.5,85 -2,85 -2,-1 102,-1 102,102 -2,102
  pour Top: -2,80 1.5,80 1.5,91 -2,91
CHARGE  (via drill 0.3, 0.6)
  Top 0.205: ADUM163N.15 46.7,14.24 46.7,13.7 46.1,13.1 v46,13.1
  Top 0.254: v17.9,23.92 v17.9,24.6 18.51,24.6 19.12,25.21 19.12,28.57 18.59,29.09 U1.3
  Top 0.305: PD_MO.2 17.9,23.1 v17.9,23.92
  Layer3 0.205: v46,13.1 45.8,14 41.1,15 37.6,15 32.7,18.9 21.5,18.9 17.9,21.5 v17.9,23.92
CHARGE_IN
  Top 0.406: ADUM163N.2 46.8,9.46 46.8,8 45.43,6.43 J1.7 44.43,5.53 PD_MI.2
FIRE_IN
  Top 0.406: ADUM163N.3 47.97,9.51 J1.6 47.97,5.07 PD_FI.2
GND  (via drill 0.3, 0.6, 0.6 pad 0.25)  (1 unrouted)
  Top 0.205: C4.2 v33.1,10.8 | ISO_OUT.2 v43.4,12.3 | FIRE_FILT.2 45.1,17.7 v44.6,17.7 | ADUM163N.9 54.61,14.2 v55.2,14.2 | U3.P$2 47.87,26.8 v46.8,26.8 | C159.1 52.7,24.86 v52.7,24.1 | C5.1 53.7,24.8 v53.7,24.1 | C56.2 v59.4,15.4 | C11.2 29.8,29.3 v30.8,29.3 | C13.2 v34,29.2 | C14.1 54,32.5 v54.7,32.5 | C15.1 v54.8,30 | C6.2 82.5,5 v83.3,5 | C10.2 v86.8,5
  Top 0.254: U1.5 17.6,27.82 | C_VCC2.2 v17.9,26.43 PD_MO.1 | LDO.P$2 v35.8,9.7 35.8,9.8 | 39.7,11.8 C12.C | 41.26,51.91 v41.26,51.7
  Top 0.305: U2.5 70.1,8.69 v70.1,7.97 | C7.2 v17.18,16.83 | v72.5,71.6 v73.8,71.6 | 74.98,71.5 v73.8,71.6 | 77.03,72.32 v76.3,71.6 v75.1,71.6 | 73.69,79.42 C157.2 | C1.2 71.03,79.87 | v73.8,71.6 73.15,71.5 U4.P$4 | v75.14,80.6 v73.14,80.6 | C_VCC1.2 v65,15 | PD_IO.1 69.9,8 70,8 70,7
  Top 0.406: C9.2 26.68,7.41 v26.51,7.89 26.51,7.1 | v75.14,80.6 75.17,80.6 C158.2 | 73.69,79.42 73.14,79.42 73.14,80 | 73.14,80 v73.14,80.6 | 71.03,79.87 71,79.87 71,80 73.14,80 | 77.03,72.32 77.52,72.32 U4.P$5 | PD_FO.1 71.9,71.6 v72.5,71.6
  Top 0.813: 17.6,27.82 C_VCC2.2
  GROUND 0.205: v33.1,10.8 32.9,10.8 32.9,11.2 | v43.4,12.3 43.2,12.3 43.2,12.2 | v44.6,17.7 44.5,18.8 44.1,17.8 | v55.2,14.2 55.4,14 | v46.8,26.8 46.2,26.8 | v52.7,24.1 52.7,23.4 | v53.7,24.1 53.6,24 54,24 | v59.4,15.4 59.4,15.6 | v30.8,29.3 31,29.1 31,29 | v34,29.2 33.9,29.1 33.6,29.1 | v54.7,32.5 54.8,32.4 55.1,32.4 | v54.8,30 55.1,30.1 55.1,30.4 | v83.3,5 84,5 | v86.8,5 86.3,5
  GROUND 0.305: v65,15 66,15
  GROUND 0.406: 19.55,35.69 18.98,36.82 | 70.56,15.84 70.29,15.75 | 71.93,14.92 71.36,16.06 | PWR.7 PWR.6 PWR.3 PWR.2
  GROUND 1.016: 40.5,47.6 40.5,32.2 36.3,27.7
  other vias: 16.6,54.8 17.82,54.8 19.04,54.8 16.6,53.58 17.82,53.58 19.04,53.58 35.17,51.7 36.39,51.7 37.6,51.7 35.17,50.48 36.39,50.48 37.6,50.48 31.25,66.43 30.03,66.43 28.82,66.43 31.25,67.65 30.03,67.65 31.25,68.87 72.34,7.97 38.82,51.7 40.04,51.7 38.82,50.48 40.04,50.48 41.26,50.48 38.82,49.26 40.04,49.26 41.26,49.26 38.82,48.05 40.04,48.05 41.26,48.05 35.17,49.26 36.39,49.26 37.6,49.26 35.17,48.05 36.39,48.05 37.6,48.05 20.26,54.8 21.48,54.8 22.7,54.8 20.26,53.58 21.48,53.58 22.7,53.58 20.26,52.36 21.48,52.36 22.7,52.36 20.26,51.14 21.48,51.14 22.7,51.14 16.6,52.36 17.82,52.36 19.04,52.36 16.6,51.14 17.82,51.14 19.04,51.14 21.48,49.92 22.7,49.92 21.48,48.71 22.7,48.71 21.48,47.49 22.7,47.49 21.48,46.27 22.7,46.27 21.48,45.05 22.7,45.05 21.48,43.83 22.7,43.83 21.48,42.61 18.43,37.73 19.65,37.73 18.43,36.51 19.65,36.51 19.65,35.29 19.65,34.08 18.43,35.29 17.21,37.73 17.21,36.51 68.85,33.81 70.07,33.81 71.29,33.81 68.85,32.59 70.07,32.59 71.29,32.59 72.51,33.81 73.73,33.81 74.95,33.81 72.51,32.59 73.73,32.59 74.95,32.59 72.51,31.37 73.73,31.37 74.95,31.37 72.51,30.15 73.73,30.15 74.95,30.15 68.85,31.37 70.07,31.37 71.29,31.37 68.85,30.15 70.07,30.15 71.29,30.15 73.73,28.93 74.95,28.93 73.73,27.71 74.95,27.71 73.73,26.49 74.95,26.49 73.73,25.27 74.95,25.27 73.73,24.06 74.95,24.06 73.73,22.84 74.95,22.84 73.73,21.62 70.81,16.97 72.02,16.97 70.81,15.75 72.02,15.75 72.02,14.53 70.81,14.53 69.59,16.97 69.59,15.75 86.93,30.63 88.15,30.63 89.37,30.63 86.93,29.41 88.15,29.41 89.37,29.41 90.59,30.63 91.81,30.63 93.03,30.63 90.59,29.41 91.81,29.41 93.03,29.41 90.59,28.2 91.81,28.2 93.03,28.2 90.59,26.98 91.81,26.98 93.03,26.98 86.93,28.2 88.15,28.2 89.37,28.2 86.93,26.98 88.15,26.98 89.37,26.98 33.69,70.09 32.47,70.09 33.69,71.31 32.47,68.87 33.69,68.87 33.69,66.44 32.47,67.66 33.69,67.66 32.47,66.44 36.74,71.31 35.52,71.31 36.74,72.53 35.52,72.53 39.17,71.31 37.96,72.53 39.17,72.53 37.96,71.31 41.61,71.31 40.39,72.53 41.61,72.53 40.39,71.31 71.25,7.97 17.18,17.74 26.15,14.84 41.61,68.87 40.39,70.09 41.61,70.09 40.39,68.87 26.51,6.98 72.51,28.93 72.51,27.71 72.51,26.49 72.51,25.27 72.51,24.06 72.51,22.84 72.51,21.62 72.51,20.4 20.26,49.92 20.26,48.71 20.26,47.49 20.26,46.27 20.26,45.05 20.26,43.83 20.26,42.61 20.26,41.39 19.65,32.86 19.65,31.64 19.04,41.39 17.82,41.39 16.6,41.39 19.04,45.05 19.04,43.83 19.04,42.61 17.82,45.05 17.82,43.83 17.82,42.61 16.6,45.05 16.6,43.83 16.6,42.61 71.38,20.36 70.16,20.36 68.94,20.36 71.38,24.02 71.38,22.8 71.38,21.58 70.16,24.02 70.16,22.8 70.16,21.58 68.94,24.02 68.94,22.8 68.94,21.58 17.9,27.04 91.88,68.19 91.88,69.41 93.1,69.41 93.1,68.19 91.88,48.68 93.1,48.68 91.88,49.9 93.1,49.9 91.88,51.12 91.88,52.34 93.1,52.34 93.1,51.12 91.88,53.56 91.88,54.78 93.1,54.78 93.1,53.56 91.88,56 91.88,57.22 93.1,57.22 93.1,56 91.88,58.44 91.88,59.66 93.1,59.66 93.1,58.44 91.88,60.87 91.88,62.09 93.1,62.09 93.1,60.87 91.88,63.31 91.88,64.53 93.1,64.53 93.1,63.31 91.88,65.75 91.88,66.97 93.1,66.97 93.1,65.75 90.66,52.34 90.66,51.12 90.66,54.78 90.66,53.56 90.66,57.22 90.66,56 90.66,59.66 90.66,58.44 90.66,62.09 90.66,60.87 90.66,64.53 90.66,63.31 90.66,65.75 90.66,66.97 89.44,51.12 89.44,52.34 88.22,52.34 88.22,51.12 39.2,11.7
  pour GROUND (isolate 0.406, no thermals): 41.9,73.42 42.51,72.81 42.51,46.57 41.59,45.66 26.05,45.66 20.71,40.37 20.56,28.06 19.04,28.06 19.04,33.47 15.99,36.51 15.99,50.23 16.02,55.11 33.97,72.89 34.58,73.42
  pour Top (no thermals): 33.97,46.27 41.9,46.27 42.51,46.88 42.51,52.06 41.9,52.67 34.58,52.67 33.97,52.06
  pour Top (no thermals): 42.51,72.81 41.9,73.42 34.58,73.42 33.97,72.81 33.97,68.82 34.58,68.21 41.9,68.21 42.51,68.82
  pour GROUND (isolate 0.406, no thermals): 93.88,53.91 93.88,25.57 92.66,24.65 78.33,24.65 72.85,19.47 72.85,8.66 71.32,8.66 71.32,13.07 68.28,16.12 68.28,29.22 68.3,34.1 88.09,53.91
  pour Top (no thermals): 86.26,25.26 93.04,25.26 93.88,25.87 93.88,31.05 93.27,31.66 86.87,31.66 86.26,31.05
  pour Top (isolate 0.406, no thermals): 75.59,21.91 72.85,19.47 72.85,14.15 72.24,14.15 71.24,14.15 68.28,16.12 68.28,34.1 68.88,34.71 74.98,34.71 75.59,34.1
  pour Top (no thermals): 27.48,66.45 27.48,65.84 27.78,65.53 33.88,65.53 34.54,66.14 34.54,73.38
  pour GROUND (isolate 0.406, no thermals): 6.87,46.5 7.06,7.28 7.67,6.54 30.8,6.57 20.57,36.58 21.16,57.13 29,63.13 27,65 7,65 7,46.5
  pour GROUND (isolate 0.4, no thermals): 13.24,25.3 69.71,25.3 72.85,20.99 72.85,7.57 62.8,7.5 55.3,11.9 45,11.9 39,10.2 39,6.5 30.25,6.57 22.94,7.58
  pour GROUND: 68.58,34.4 55.47,20.99 54.25,19.16 69.49,19.16 77.72,27.39 77.72,28.31 71.63,34.4
  pour Top (isolate 0.305, no thermals): 69.49,8.58 72.85,8.58 72.85,7.57 69.49,7.57
  pour Top (isolate 0.305, no thermals): 41.81,93.96 34.8,93.96 33.88,93.05 33.88,68.88 34.49,68.28 41.81,68.28 42.49,68.88 42.49,93.05
  pour Top (isolate 0.406, no thermals): 22.77,55.69 23.38,55.08 23.38,43.2 20.64,40.45 20.64,31.61 16.07,36.19 16.07,55.08 16.68,55.69
  pour Top (isolate 0.406, no thermals): 18.81,33.44 18.81,31 20.64,31 20.64,33.44
  pour GROUND (no thermals): 93.89,53.86 93.89,54.75 71.43,54.75 40.45,22.77 62.92,22.77
  pour Top (no thermals): 87.61,47.16 93.4,47.16 94.01,47.77 94.01,74.29 93.4,74.9 91.57,74.9 90.96,74.29 90.96,69.41 87,65.45 87,47.77
  pour GROUND (no thermals): 92.79,47.16 87.61,47.16 87,47.77 87,65.45 90.96,69.41 90.96,74.29 91.57,74.9 93.4,74.9 93.86,74.29 93.86,54.47 93.4,47.77
  pour GROUND: 71,54 71,79 73,81 94,81 94,53
  pour GROUND: 29,26.8 36.4,26.9 38.8,29.8 28.9,29.8
  pour GROUND: 81,8 88,8 92,11 92,28 94,28 94,11 89,7 89,4 81,4
I_DONE
  Top 0.406: J1.2 55.71,9 53.2,9 53.17,9.18 ADUM163N.7
IG_!DONE
  Top 0.254: ADUM163N.10 53.17,15.18 53,17 55,17 60,10 65.4,10 RLED1.2
  Top 0.305: U2.2 R!DONE1.2 | R!DONE1.2 | R!DONE1.2 65.58,10.19 RLED1.2
IG_BG
  pour Top (no thermals): 73.89,18.64 73.89,10.67 74.6,10.67 74.6,18.64
IG_DRAIN
  pour Top (isolate 0.406, no thermals): 93.88,43.24 92.96,43.85 78.03,43.85 76.5,42.33 76.5,14.59 77.11,13.98 84.43,13.98 85.04,14.59 85.04,31.97 85.65,32.58 92.96,32.58 93.88,33.49
IG_GATE
  pour Top (no thermals): 86.87,17.64 86.56,17.34 86.56,13.98 86.87,13.68 89.92,13.68 90.22,13.98 90.22,17.34 89.92,17.64
IG_SENSE
  Top 0.205: C10.1 86.1,6.8 RPI5.1 88,7 93,11 93,22
  pour Top (no thermals): 86.56,24.65 86.26,24.35 86.26,20.08 86.56,19.77 93.96,19.77 93.88,24.35 93.27,24.65
IG_VOUT
  pour Top (no thermals): 55.29,55.36 65.05,55.36 73.66,54.97 72.62,55.64 74.03,55.65 61.66,71.71 58,71.71 58,94 54.54,94 54.74,68.93
  pour Top (no thermals): 74,56 74,64 arc-90 64,74 64,94 55,94 56,60 71,60 71,56
  pour Top (no thermals): 74,56 74,64 arc-90 64,74 64,94 56,94 56,60 71,60 71,56
IGBT_GATE
  Top 0.406: 81.59,75 82,74 81.8,73.8 81,73.8 | U$14.1 81,73.52 81,73.8 | 81,75 81,73.8
  pour Top (no thermals): 77,75 82,75 82,71 80,71 78.9,73.7 77,74
IGN_IN
  Top 0.406: ADUM163N.4 49.4,9.27 49.4,8 49.42,7.58 J1.5 50.51,5.39 PD_II.2
IGN_OUT  (via drill 0.4, 0.6)
  Top 0.205: v48.1,13.1 49.37,13.27 ADUM163N.13
  Top 0.254: v67,9 68,9 68.69,9.69 U2.3
  Top 0.305: PD_IO.2 68.1,9 v67,9
  Layer3 0.254: v48.1,13.1 48.7,12.6 55,12.6 60,9 v67,9
IGN_OUT_GND
  pour Top (isolate 0.406, no thermals): 79.86,94.96 78.94,94.05 78.94,79.77 79.55,79.16 94.49,79.16 95.1,79.77 95.1,94.05 94.18,94.96
IGNITER_FIRE  (via drill 0.6)  (1 unrouted)
  Top 0.305: ADUM163N.14 48,14.46 | v70,75 71,75.02 | 71,75.02 72.93,75.07 U4.P$2 | C1.1 71,75.02 | FIRE_FILT.1 v50.2,17.9
  Top 0.406: PD_FO.2 70,71 v70,75
  Layer3 0.305: v50.2,17.9 48.5,16.3 56.9,16.1 57.4,16.7 57.3,16.2 57.8,16.2 57.9,27.7 77.9,47.9 78,63 70,72 v70,75
M_!DONE  (via drill 0.6)
  Top 0.205: ADUM163N.12 50.7,14.3 50.7,13.8 51.1,13.4 v50.6,13.5
  Top 0.254: R!DONE.1 16.03,29.59 U1.2 19.62,29.59 20.34,28.87 20.34,23.97 RLED.2 20,23.63 v20,23
  Layer3 0.205: v50.6,13.5 50.1,14.6 45.1,14.6 41.2,15.5 37.8,15.5 32.8,19.5 22,19.5 v20,23
M_BG
  pour Top (isolate 0.254, no thermals): 21.5,34.44 21.6,30.06 22.31,30.06 22.21,34.44
M_DIV
  Top 0.205: FERRITE1.1 51.7,32.6 C14.2 47.1,38.6 FERRITE.2
  Top 0.406: FERRITE.2 C2.1
M_DRAIN
  pour Top (isolate 0.406, no thermals): 42.51,64.25 41.59,64.86 25.74,64.86 24.22,63.34 24.22,35.29 24.83,34.68 27.54,34.68 27.5,37.2 32.45,37.09 32.75,52.97 33.36,53.58 41.99,53.58 42.5,54.09
M_GATE
  pour Top (no thermals): 34.58,38.65 34.28,38.34 34.28,34.99 34.58,34.68 35.73,34.68 37.94,36.89 37.94,38.34 37.63,38.65
M_SENSE
  Top 0.205: RPI1.1 33.5,27.4 C13.1 35.3,27.6 36.2,27.6 40.5,31.9 40.5,42.3
  pour Top (no thermals): 34.28,45.66 33.97,45.35 33.97,41.09 34.28,40.78 41.29,40.78 42.81,40.76 42.81,45.35 42.2,45.66
M_SMT  (via drill 0.5, 0.6)
  Top 0.305: U3.P$4 50,25.96 v50,25 | v51.9,18.2 51.91,15 ADUM163N.11
  Layer3 0.205: v51.9,18.2 50,21.3 v50,25
M_VOUT
  pour Top (no thermals): 7.39,90.02 7.39,84.41 8.39,83.41 25.12,83.41 26.12,84.41 26.12,90.02 22.12,94.02 11.39,94.02
MAIN_DONE
  Top 0.406: J1.4 52.63,7 52,8 50.63,9.37 ADUM163N.5
N$1
  Top 0.205: U2.6 76.84,7 C6.1 RPI5.2
N$2
  Top 0.254: U3.P$6 49,27.86 49,26 47.98,26 U3.P$3
N$3
  Top 0.254: U1.9 23.24,29.59 24.97,31.12 RVOUT.1
N$4
  Top 1.422: D4.C D10.A
N$5
  Top 0.254: U1.8 24.89,29.09 26.91,31.12 RDCM.1
N$6
  Top 0.254: U1.7 25.97,28.59 30.61,33.23 35.21,33.23 RGATE.1
N$7
  Top 1.422: D5.C D11.A
N$8
  Top 0.205: U3.P$1 50.22,30.1 FERRITE1.2 51.1,30 C15.2
N$10
  Top 1.422: D1.C 8.89,78.58 D7.A
N$11
  Top 1.422: D2.C 12.89,78.59 D8.A
N$12
  Top 1.422: D3.C D9.A
N$14  (via drill 0.5)
  Top 0.406: R1.1 v32,88 | R2.2 v49,88 49,86.9 FERRITE.1
  GROUND 0.406: v32,88 v49,88
N$15
  Top 0.254: 24,23.9 LED!DONE.C
  Top 1.27: RLED.1 24,23.9
N$17
  Top 1.016: RLED1.1 62.52,11.98 LED!DONE1.C
N$18
  pour Top (isolate 0.406, no thermals): 8.53,75.5 7.92,74.9 7.92,69.1 8.53,68.49 11.8,68.49 17.37,73.07 25.3,73.07 25.91,73.68 25.91,74.9 25.3,75.5
N$20
  Top 0.205: U1.6 21.95,28 26.1,28 26.7,27.4 C11.1 29.9,27.6 RPI1.2
N$24
  pour Top (no thermals): 55.38,52.92 55.38,51.09 56.3,50.18 62.68,48.38 63.59,47.46 65.82,47.46 64.94,52.68 56,53.04
N$25
  Top 0.305: C3.2 36.75,12.75 LDO.P$4
SGND  (via drill 0.6)
  Top 0.205: ISO_IN.2 41.4,9.14 v41.4,8.9 | 55.88,10.2 v56,10.2
  Top 0.406: v56,10.2 57.05,10.2 J1.1 60,6.58 60,5 PD_II.1 | 55.88,10.2 55.45,10.64 ADUM163N.8 | PD_MI.1 v41,5 | PD_FI.1 v46,4.2
  Layer3 0.205: v41.4,8.9 40.9,8.9 | v56,10.2 55.3,9.5 55.4,9.5
  Layer3 0.406: 40.9,8.9 40.9,5.1 v41,5 v46,4.2
  pour Layer3: 40,4 62,4 62,7 55,11 45,11 40,9.5
SMT_OUT
  Top 0.406: J1.3 55.17,8 53,8 51.91,9.1 ADUM163N.6
VBAT
  Top 0.406: PWR.8 PWR.5 PWR.4 PWR.1 20.73,16.51 C7.1
  pour Top (no thermals): 24,17 26,14 26,9 24,6 21,6 20,7 20,17
VLDO  (via drill 0.4, 0.5, 0.6)
  Top 0.203: C12.A 37.1,15.1 36.8,15.4
  Top 0.205: C12.A ISO_OUT.1 45.55,14.1 ADUM163N.16 | U3.P$5 50.83,26.76 C159.2 53.04,27 54.1,27 | 54.1,27 55,27 v55,23 48,23 47.3,23.7 v47.2,23.7 | v36.6,17.7 36.8,15.4 v34.8,15.4 | v56,18 v59,13 60,13.2 C56.1 | v67,13 67.4,12.6 R!DONE1.1 | C5.2 54.1,27
  Top 0.254: 34.9,11.2 35,11 v34.8,15.4 | v14,31.4 13.82,30 R!DONE.2
  Top 0.305: LDO.P$5 34.9,11.2 C3.1
  Layer3 0.205: v34.8,15.4 30.9,18.3 16,18.3 12.6,24.2 12.6,28.9 12.7,30 v14,31.4 | v47.2,23.7 47.1,23.6 42.8,23.6 38.9,19.7 v36.6,17.7 | v55,23 v56,18 | v59,13 v67,13
VSIG
  Top 0.205: ISO_IN.1 44.29,10.64 ADUM163N.1
  Top 0.406: J1.8 45.55,9.25 ADUM163N.1 45.5,9.64
VTRANS_PWR  (via drill 0.6)  (1 unrouted)
  Top 0.203: LDO.P$1 35,8.3 35,7 37,7 37,8.15 36.75,8.4
  Top 0.205: 36.75,8.4 LDO.P$3 | 29.6,10.4 29.6,11.27 | U$2.P$3 65.02,42 67,42 67,39
  Top 0.254: U1.1 17.8,30.27 | 17.8,31.64 17.4,31.51 C_TRANS.1 | U1.4 14.09,28.59
  Top 0.305: 70.09,11.99 C_TRANS1.1 | U2.4 71.63,9.19 71.63,9.5 | LDO.P$1 34.8,8.4 | 74.66,76.34 v75,76 75.17,76 C158.1 | U4.P$1 73.17,76.34 C157.1
  Top 0.406: U4.P$1 74.66,76.34 U4.P$8 | 30.1,8.27 C4.1 34.9,8.45 LDO.P$1 | 67,39 78,50 v81,50
  Top 0.61: 17.8,30.27 17.8,31.64
  Top 0.813: LED!DONE.A 27.2,22 27,22
  Layer3 0.406: v81,50 81,68 79,70 79,71 75,75 v75,76
  pour Top (no thermals): 69.8,10.72 71.02,10.72 71.02,13.15 67.36,15.81 67.46,42.34 66.75,42.85 60.55,42.85 58.75,41.58 58.83,22.43 69.8,12.46
  pour Top (isolate 0.406, no thermals): 71.02,13.15 71.02,9.19 72.9,9.19 72.9,11.27
  pour Top (isolate 0.406, no thermals): 66.45,22.21 31,22 15.46,22.21 17.46,18.34 30.79,16.68 66.45,16.73
  pour Top (isolate 0.406): 58.83,23.43 58.83,18.56 60.05,17.34 66.45,17.34 66.75,17.64 66.75,28 66.45,28.31 61.57,28.31 59.44,26.18 59.44,24.04
  pour Top (isolate 0.406, no thermals): 15.15,64.53 14.85,64.84 7.23,64.84 6.92,64.53 6.92,26.48 12.41,18.99 13.41,18.29 18.02,17.68 24.15,17.68 22.37,17.98 16.37,28.49 15.15,29.1 15.15,30.39 15.76,30.93 17.9,30.93 17.9,33.14 15.15,35.88
  pour Top (rank 2, no thermals): 29,6 28,7 28,18 31,18 31,6

### Text on the board
_tsilk: IGN / HIGH VOUT+ | MAIN / HIGH VOUT+ | GND | GND | DANGER | HIGH / VOLTAGE | RSENSE | R!DONE | R_BG | RGATE | C_TRANS | C_BG | RDCM | RVOUT | SCHMITT / TRIGGER | C_VCC | RLED | LED_MAIN | RSENSE | RDAMP | C_BG | LDO | Isolation | R_BG | C_VCC | C_TRANS | RGATE | LED_IGNITER | RDCM | R!DONE | RVOUT | RLED
_bsilk: PAIGE N`orthway / UW CUBE SATELLITE / MAIN/IGNITER CHARGER / VERSION 4 / 07/12/2017